# Altium schematic sheet XRACER-IMU-R07.SchDoc
size A4
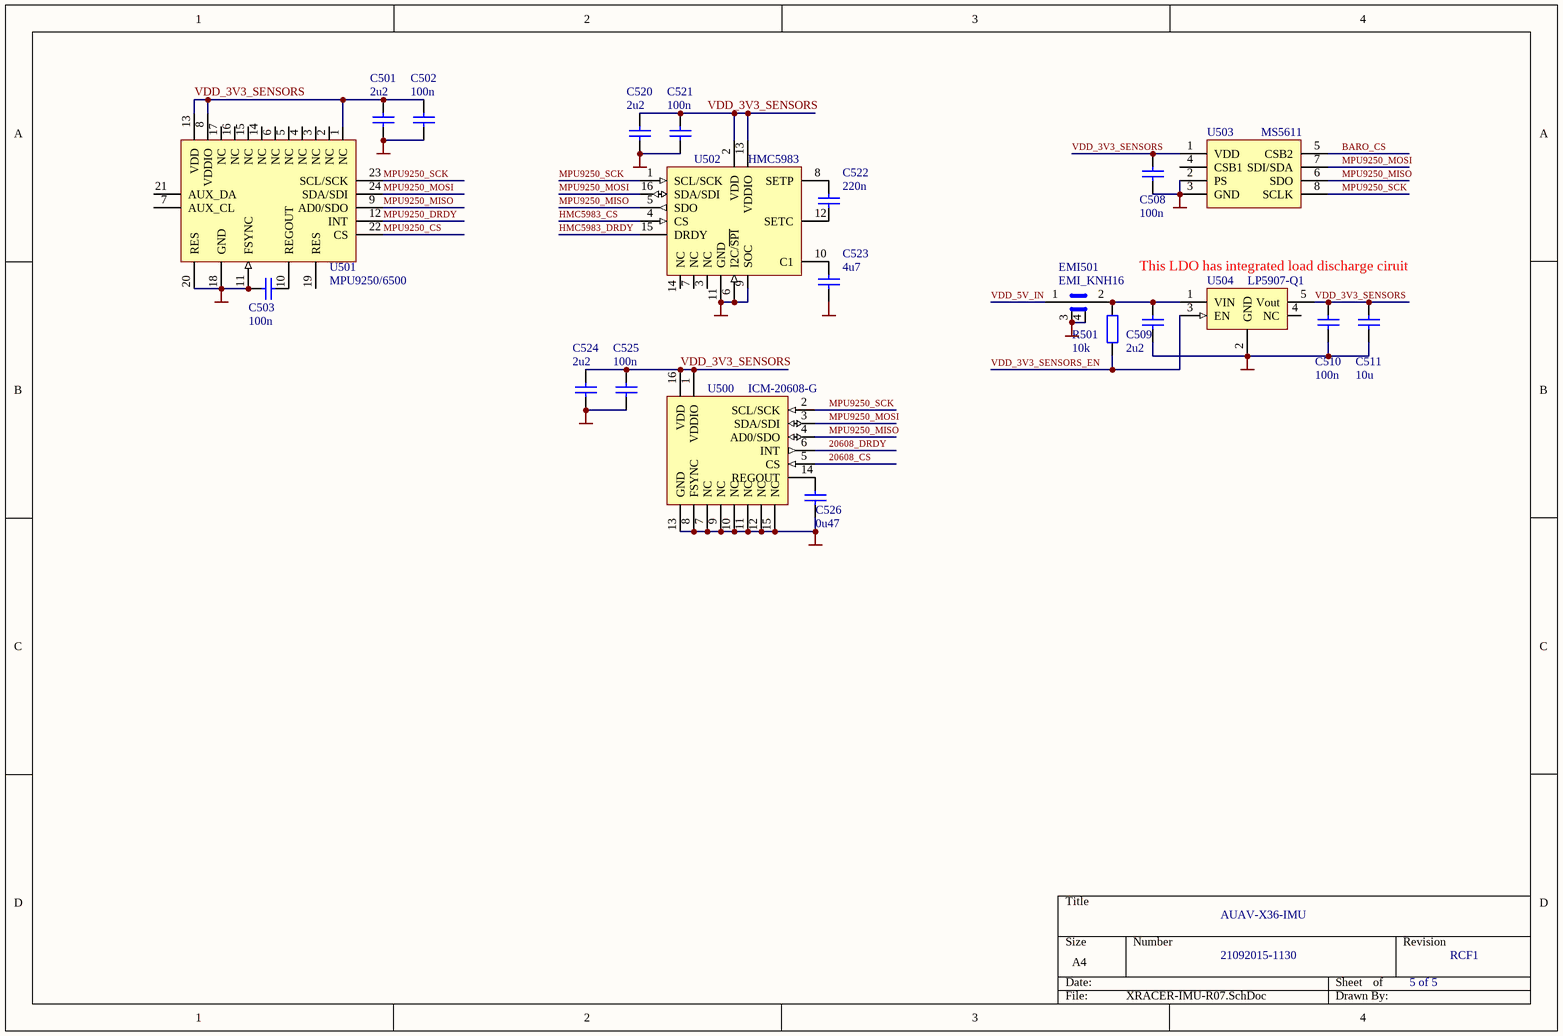
[diagram p0: XRACER-IMU-R07.SchDoc]

## Parts
C501  2u2  [0402A]
C502  100n  [0402A]
C503  100n  [0402A]
C508  100n  [0402A]
C509  2u2  [0603A]
C510  100n  [0603A]
C511  10u  [0603A]
C520  2u2  [0402A]
C521  100n  [0402A]
C522  220n  [0402A]
C523  4u7  [0603A]
C524  2u2  [0402A]
C525  100n  [0402A]
C526  0u47  [0402A]
EMI501  EMI_KNH16  [EMI_KNH16_0603]
R501  10k  [0603A]
U500  ICM-20608-G  [HCLGA-16L]
U501  MPU9250/6500  [MPU6500-9250]
U502  HMC5983  [HMC5883L]
U503  MS5611  [MS5611]
U504  LP5907-Q1  [SOT23-5]

## Nets
GND: C501.1 C502.1 C503.1 C508.1 C509.1 C510.1 C511.1 C520.1 C521.1 C523.1 C524.1 C525.1 C526.1 EMI501.3(G) EMI501.4(G) U500.7(NC) U500.8(FSYNC) U500.9(NC) U500.10(NC) U500.11(NC) U500.12(NC) U500.13(GND) U500.15(NC) U501.11(FSYNC) U501.18(GND) U501.20(RES) U502.6(I2C/~{SPI}) U502.9(SOC) U502.11(GND) U503.2(PS) U503.3(GND) U504.2(GND)
20608_CS: U500.5(CS)
20608_DRDY: U500.6(INT)
BARO_CS: U503.5(CSB2)
HMC5983_CS: U502.4(CS)
HMC5983_DRDY: U502.15(DRDY)
MPU9250_CS: U501.22(CS)
MPU9250_DRDY: U501.12(INT)
MPU9250_MISO: U500.4(AD0/SDO) U501.9(AD0/SDO) U502.5(SDO) U503.6(SDO)
MPU9250_MOSI: U500.3(SDA/SDI) U501.24(SDA/SDI) U502.16(SDA/SDI) U503.7(SDI/SDA)
MPU9250_SCK: U500.2(SCL/SCK) U501.23(SCL/SCK) U502.1(SCL/SCK) U503.8(SCLK)
VDD_3V3_SENSORS: C501.2 C502.2 C508.2 C510.2 C511.2 C520.2 C521.2 C524.2 C525.2 U500.1(VDDIO) U500.16(VDD) U501.1(NC) U501.8(VDDIO) U501.13(VDD) U502.2(VDD) U502.13(VDDIO) U503.1(VDD) U504.5(Vout)
VDD_3V3_SENSORS_EN: R501.1 U504.3(EN)
VDD_5V_IN: EMI501.1(L1)
NetC503_2: C503.2 U501.10(REGOUT)
NetC509_2: C509.2 EMI501.2(L2) R501.2 U504.1(VIN)
NetC522_1: C522.1 U502.12(SETC)
NetC522_2: C522.2 U502.8(SETP)
NetC523_2: C523.2 U502.10(C1)
NetC526_2: C526.2 U500.14(REGOUT)

Not connected (* = marked no-connect by the designer): U501 2(NC) 3(NC) 4(NC) 5(NC) 6(NC) 7(AUX_CL) 14(NC) 15(NC) 16(NC) 17(NC) 19(RES) 21(AUX_DA); U502 3(NC) 7(NC) 14(NC); U503 4(CSB1); U504 4(NC)

## Notes on the sheet
- This LDO has integrated load discharge ciruit
- AUAV-X36-IMU
- 21092015-1130
- 5 of 5
- RCF1

## Library data of the parts
C501-C503 C508-C511 C520-C526 = Cap: Capacitor; Value: 100pF; Published: 8-Jun-2000; LatestRevisionDate: 17-Jul-2002; LatestRevisionNote: Re-released for DXP Platform.; PackageReference: RAD-0.3; Publisher: Altium Limited
R501 = Res2: Resistor; Value: 1K; Published: 8-Jun-2000; LatestRevisionDate: 17-Jul-2002; LatestRevisionNote: Re-released for DXP Platform.; PackageReference: AXIAL-0.4; Publisher: Altium Limited
U501 = MPU6500
U503 = MS5611-01BA03